# Altium schematic sheet Sheet2.SchDoc
size A4
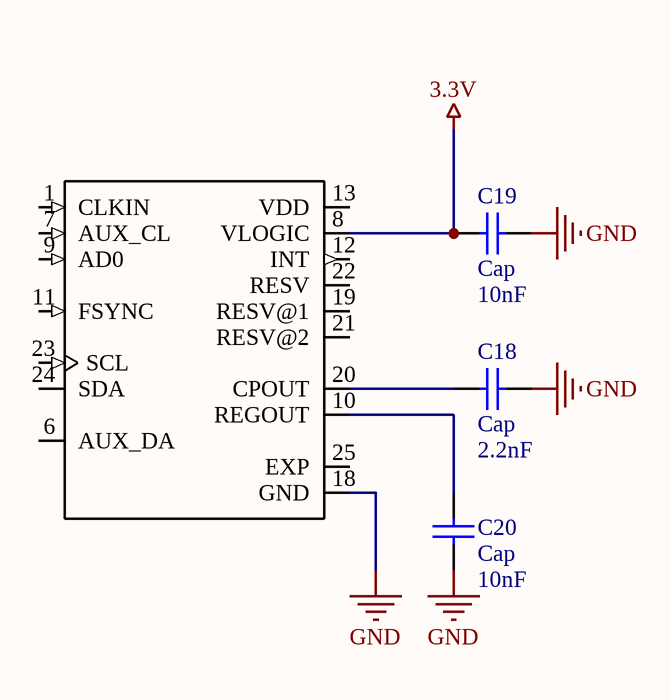
[diagram p0: Sheet2.SchDoc]

## Parts
C18  Cap  value 2.2nF  [C0805]
C19  Cap  value 10nF  [C0805]
C20  Cap  value 10nF  [C0805]
U?  MPU-6050  [QFN50P400X400X95-25N]  (value not drawn)

## Nets
3.3V: C19.1 U?.8(VLOGIC)
GND: C18.1 C19.2 C20.1 U?.18(GND)
NetC18_2: C18.2 U?.20(CPOUT)
NetC20_2: C20.2 U?.10(REGOUT)

Not connected (* = marked no-connect by the designer): U? 1(CLKIN) 6(AUX_DA) 7(AUX_CL) 9(AD0) 11(FSYNC) 12(INT) 13(VDD) 19(RESV@1) 21(RESV@2) 22(RESV) 23(SCL) 24(SDA) 25(EXP)

## Library data of the parts
C18-C20 = Cap: Capacitor; Published: 8-Jun-2000; LatestRevisionDate: 17-Jul-2002; LatestRevisionNote: Re-released for DXP Platform.; PackageReference: RAD-0.3; Publisher: Altium Limited; PackageDescription: Radial Cap, Thru-Hole; 2 Leads; 0.3 in Pin Spacing
U? = MPU-6050: 3-axis gyroscope, 3-axis accelerometer in a 4x4x0.9 housing; MF: InvenSense; Price: 7.53 USD; Package: QFN-24 InvenSense; MP: MPU-6050; Availability: Good; Value: *